# EAGLE schematic ADE7753Schematic-Arduino (EAGLE 6.5.0)
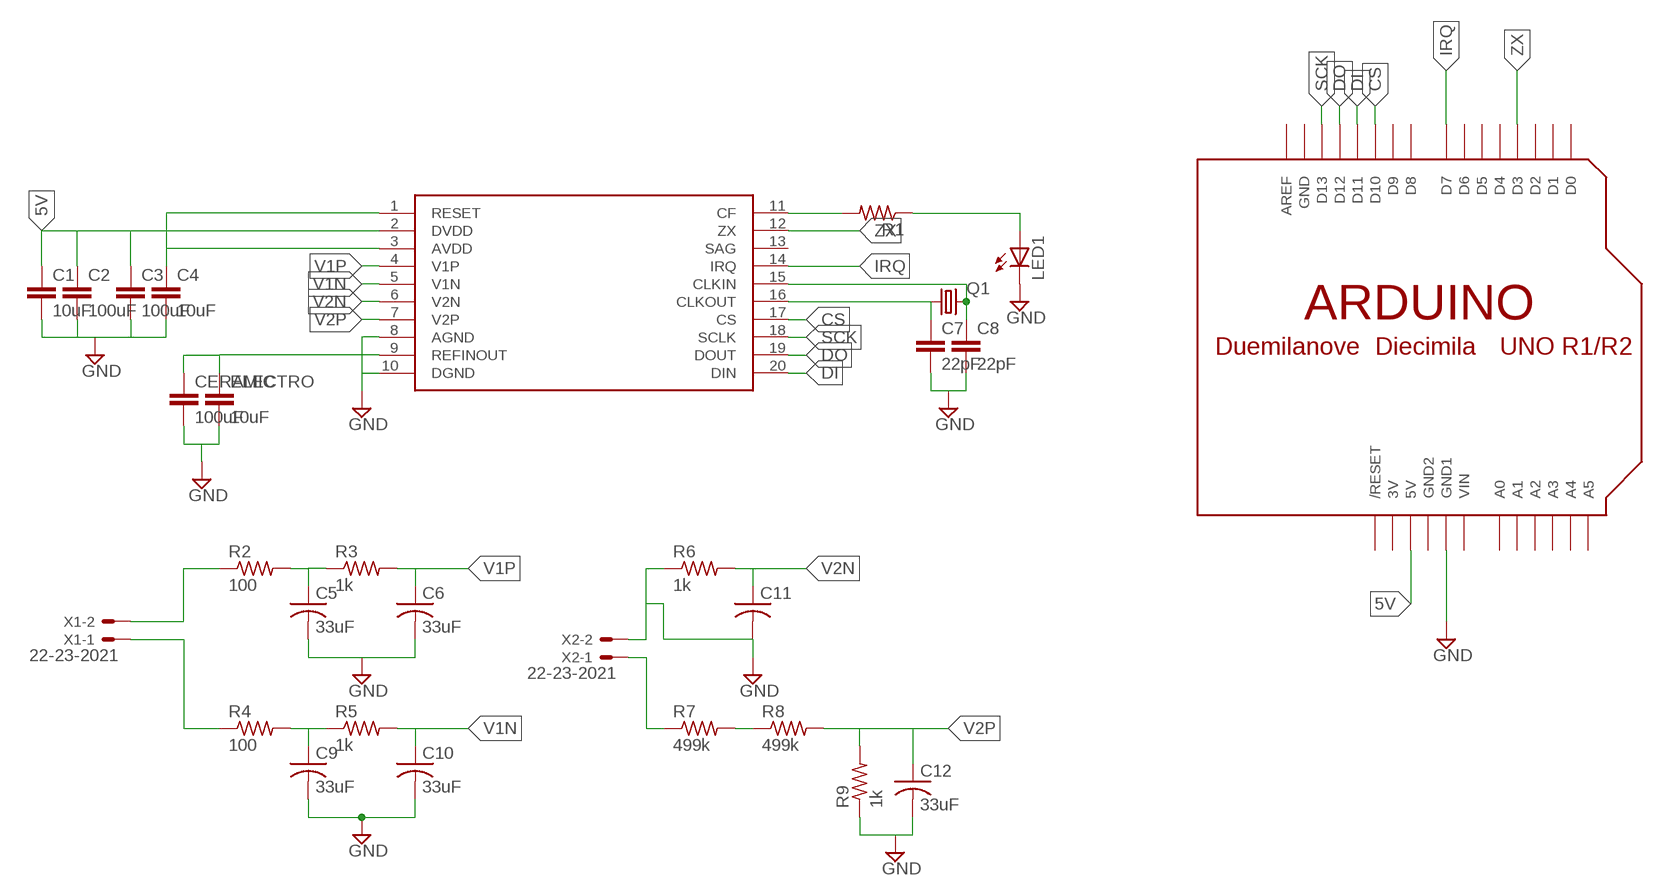
[diagram p0: schematic, sheet 1]

## Parts
C1  10uF  C2.5/2  [C2.5-2]
C2  100uF  C2.5/2  [C2.5-2]
C3  100uF  C2.5/2  [C2.5-2]
C4  10uF  C2.5/2  [C2.5-2]
C5  33uF  C-USC0402K  [C0402K]
C6  33uF  C-USC0402K  [C0402K]
C7  22pF  C2.5/2  [C2.5-2]
C8  22pF  C2.5/2  [C2.5-2]
C9  33uF  C-USC0402K  [C0402K]
C10  33uF  C-USC0402K  [C0402K]
C11  C-USC0402K  [C0402K]
C12  33uF  C-USC0402K  [C0402K]
CERAMIC  100uF  C2.5/2  [C2.5-2]
ELECTRO  10uF  C2.5/2  [C2.5-2]
LED1  LED3MM  [LED3MM]
Q1  CRYSTALHC49S  [HC49/S]
R1  R-US_0204/2V  [0204V]
R2  100  R-US_R0603  [R0603]
R3  1k  R-US_R0603  [R0603]
R4  100  R-US_R0603  [R0603]
R5  1k  R-US_R0603  [R0603]
R6  1k  R-US_R0603  [R0603]
R7  499k  R-US_R0603  [R0603]
R8  499k  R-US_R0603  [R0603]
R9  1k  R-US_R0603  [R0603]
U$1  ADE7753  [SSOP20]
U$2  ARDUINO-NOHOLE  [ARDUINO-NOHOLE]
X1  22-23-2021  [22-23-2021]
X2  22-23-2021  [22-23-2021]

## Nets
5V: C1.1 C2.1 C3.1 C4.1 U$1.1(RESET) U$1.2(DVDD) U$1.3(AVDD) U$2.5V
CS: U$1.17(CS) U$2.D10
DI: U$1.20(DIN) U$2.D11
DO: U$1.19(DOUT) U$2.D12
GND: C1.2 C2.2 C3.2 C4.2 C5.2 C6.2 C7.2 C8.2 C9.2 C10.2 C11.2 C12.2 CERAMIC.2 ELECTRO.2 LED1.K(C) R6.1 R9.1 U$1.8(AGND) U$1.10(DGND) U$2.GND1 X2.2
IRQ: U$1.14(IRQ) U$2.D7
N$2: C8.1 Q1.2 U$1.15(CLKIN)
N$3: CERAMIC.1 ELECTRO.1 U$1.9(REFINOUT)
N$4: C7.1 Q1.1 U$1.16(CLKOUT)
N$5: R1.2 U$1.11(CF)
N$6: LED1.A R1.1
N$7: C5.1 R2.2 R3.1
N$8: R2.1 X1.2
N$9: C9.1 R4.2 R5.1
N$10: R4.1 X1.1
N$11: R7.2 R8.1
N$13: R7.1 X2.1
SCK: U$1.18(SCLK) U$2.D13
V1N: C10.1 R5.2 U$1.5(V1N)
V1P: C6.1 R3.2 U$1.4(V1P)
V2N: C11.1 R6.2 U$1.6(V2N)
V2P: C12.1 R8.2 R9.2 U$1.7(V2P)
ZX: U$1.12(ZX) U$2.D3
Unconnected: U$1.13(SAG) U$2.A0 U$2.A1 U$2.A2 U$2.A3 U$2.A4 U$2.A5 U$2.AREF U$2.D0 U$2.D1 U$2.D2 U$2.D4 U$2.D5 U$2.D6 U$2.D8 U$2.D9 U$2.RESET(/RESET)

## Power pins joined to a net without a drawn wire
3V: U$2.3V
GND: U$2.GND
GND2: U$2.GND2
VIN: U$2.VIN

## Library data of the parts
C1-C4 C7 C8 CERAMIC ELECTRO = capacitor-wima:C: CAPACITOR naming: grid - package width
C5 C6 C9-C12 = rcl:C-US: CAPACITOR, American symbol
LED1 = adafruit:LED: LED OSRAM: - CHIPLED LG R971, LG N971, LY N971, LG Q971, LY Q971, LO R971, LY R971 LH N974, LH R974 LS Q976, LO Q976, LY Q976 LO Q996 - Hyper CHIPLED LW Q18S LB Q993, LB Q99A, LB R99A - SideLED LS A670, LO A670, LY A670, LG A670, LP A670 LB A673, LV A673, LT A673, LW A673 LH A674 LY A675 LS A676, LA A676, LO A676, LY A676, LW A676 LS A679, LY A679, LG A679 - Hyper Micro SIDELED® LS Y876, LA Y876, LO Y876, LY Y876 LT Y87S - SmartLED LW L88C, LW L88S LB L89C, LB L89S, LG L890 LS L89K, LO L89K, LY L89K LS L896, LA L896, LO L896, LY L896 - TOPLED LS T670, LO T670, LY T670, LG T670, LP T670 LSG T670, LSP T670, LSY T670, LOP T670, LYG T670 LG T671, LOG T671, LSG T671 LB T673, LV T673, LT T673, LW T673 LH T674 LS T676, LA T676, LO T676, LY T676, LB T676, LH T676, LSB T676, LW T676 LB T67C, LV T67C, LT T67C, LS T67K, LO T67K, LY T67K, LW E67C LS E67B, LA E67B, LO E67B, LY E67B, LB E67C, LV E67C, LT E67C LW T67C LS T679, LY T679, LG T679 LS T770, LO T770, LY T770, LG T770, LP T770 LB T773, LV T773, LT T773, LW T773 LH T774 LS E675, LA E675, LY E675, LS T675 LS T776, LA T776, LO T776, LY T776, LB T776 LHGB T686 LT T68C, LB T68C - Hyper Mini TOPLED® LB M676 - Mini TOPLED Santana® LG M470 LS M47K, LO M47K, LY M47K Source: http://www.osram.convergy.de/
Q1 = adafruit:CRYSTAL: CRYSTAL; OC_FARNELL: 1667008; OC_NEWARK: unknown
R1-R9 = adafruit:R-US_: RESISTOR, American symbol
U$1 = ade7735:ADE7753
U$2 = adafruit:ARDUINO: Arduino Diecimila/Duemilanove Make a shield with ease, this package has all the named pins as well as the two mounting drill holes and an outline of the USB and DC power connector. The outline is on the DIMENSION layer, so if your board house uses it they will cut the outline to match. http://www.ladyada.net/library/pcb/eaglelibrary.html
X1 X2 = con-molex:22-23-2021: .100" (2.54mm) Center Header - 2 Pin; MF: MOLEX; MPN: 22-23-2021; OC_FARNELL: 1462926; OC_NEWARK: 25C3832